# Altium schematic sheet [2] Sensors.SchDoc
size A4; DocumentNumber: 3; SheetNumber: 3; SheetTotal: 5
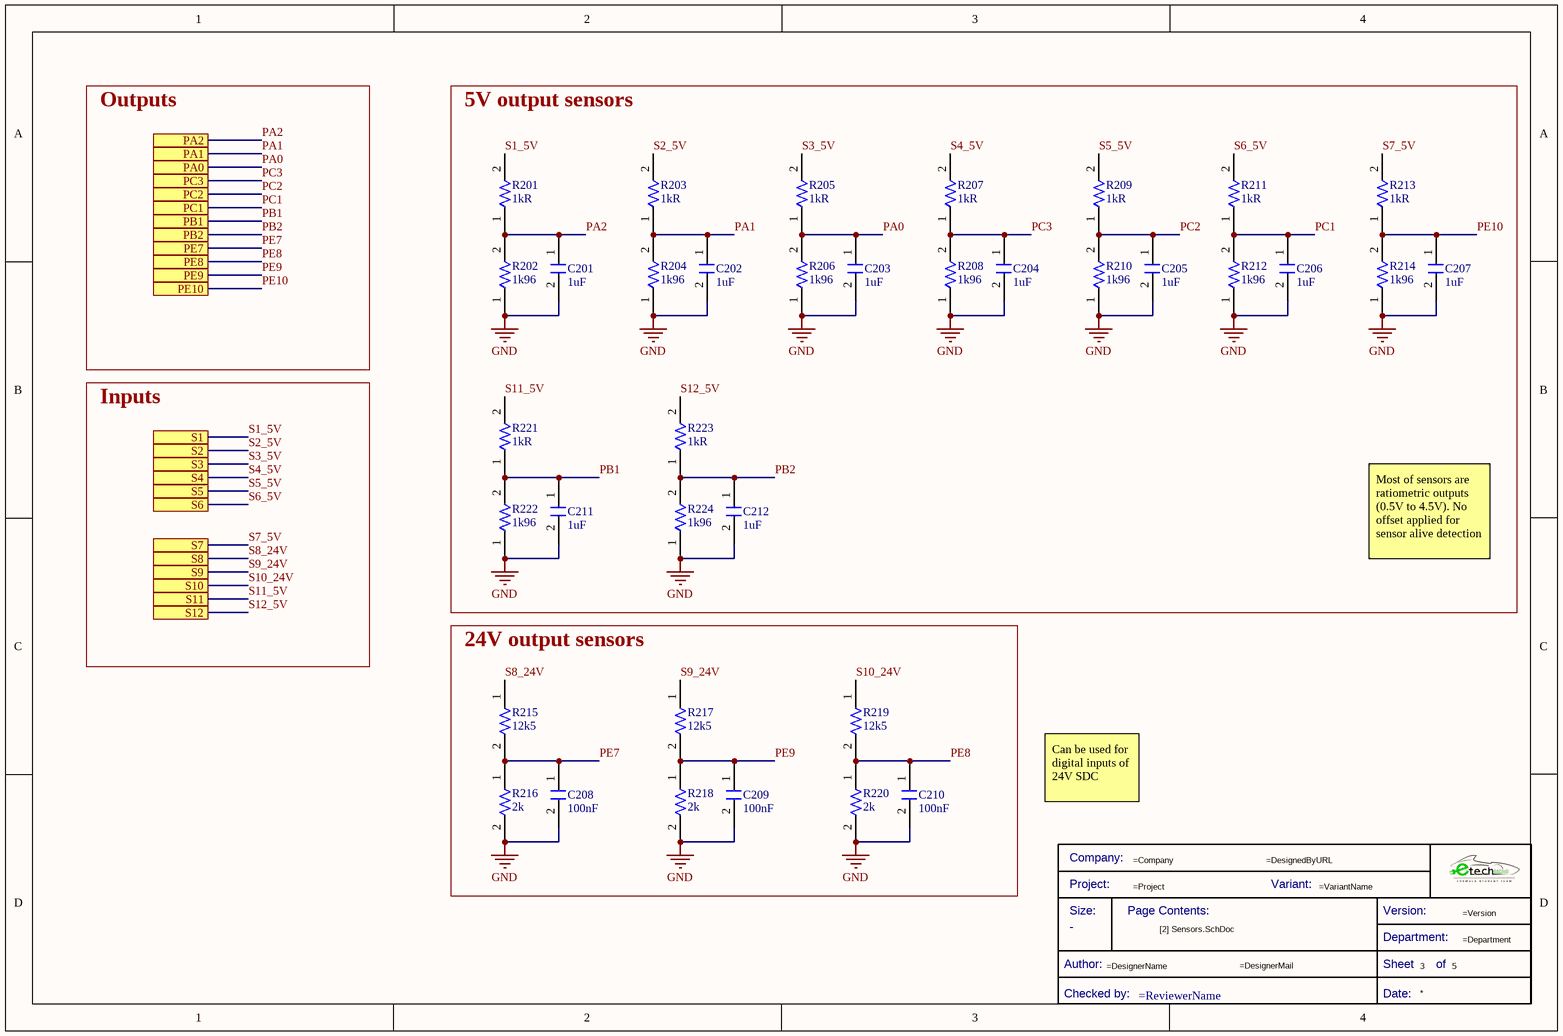
[diagram p0: [2] Sensors.SchDoc]

## Parts
*  Title Block_template  (value not drawn)  (graphical)
C201  Capacitance: 1uF  [C0805FNPC-R]  (hidden comment: 885012207103)
C202  Capacitance: 1uF  [C0805FNPC-R]  (hidden comment: 885012207103)
C203  Capacitance: 1uF  [C0805FNPC-R]  (hidden comment: 885012207103)
C204  Capacitance: 1uF  [C0805FNPC-R]  (hidden comment: 885012207103)
C205  Capacitance: 1uF  [C0805FNPC-R]  (hidden comment: 885012207103)
C206  Capacitance: 1uF  [C0805FNPC-R]  (hidden comment: 885012207103)
C207  Capacitance: 1uF  [C0805FNPC-R]  (hidden comment: 885012207103)
C208  Capacitance: 100nF  [C0805FNPC-R]  (hidden comment: 885012207098)
C209  Capacitance: 100nF  [C0805FNPC-R]  (hidden comment: 885012207098)
C210  Capacitance: 100nF  [C0805FNPC-R]  (hidden comment: 885012207098)
C211  Capacitance: 1uF  [C0805FNPC-R]  (hidden comment: 885012207103)
C212  Capacitance: 1uF  [C0805FNPC-R]  (hidden comment: 885012207103)
R201  Resistance: 1kR  [R0805FTK]  (hidden comment: CR0805-JW-102ELF)
R202  1k96  [R0805FTK]
R203  Resistance: 1kR  [R0805FTK]  (hidden comment: CR0805-JW-102ELF)
R204  1k96  [R0805FTK]
R205  Resistance: 1kR  [R0805FTK]  (hidden comment: CR0805-JW-102ELF)
R206  1k96  [R0805FTK]
R207  Resistance: 1kR  [R0805FTK]  (hidden comment: CR0805-JW-102ELF)
R208  1k96  [R0805FTK]
R209  Resistance: 1kR  [R0805FTK]  (hidden comment: CR0805-JW-102ELF)
R210  1k96  [R0805FTK]
R211  Resistance: 1kR  [R0805FTK]  (hidden comment: CR0805-JW-102ELF)
R212  1k96  [R0805FTK]
R213  Resistance: 1kR  [R0805FTK]  (hidden comment: CR0805-JW-102ELF)
R214  1k96  [R0805FTK]
R215  12k5  [R0805FTK]
R216  2k  [R0805FTK]
R217  12k5  [R0805FTK]
R218  2k  [R0805FTK]
R219  12k5  [R0805FTK]
R220  2k  [R0805FTK]
R221  Resistance: 1kR  [R0805FTK]  (hidden comment: CR0805-JW-102ELF)
R222  1k96  [R0805FTK]
R223  Resistance: 1kR  [R0805FTK]  (hidden comment: CR0805-JW-102ELF)
R224  1k96  [R0805FTK]

## Blocks framed on the sheet
5V output sensors: C201-C207 C211 C212 R201-R214 R221-R224
24V output sensors: C208-C210 R215-R220

## Ports
PA0 (see ETRX_FECU[2A], [1] Shield[3A]), PA1 (see ETRX_FECU[2A], [1] Shield[3A]), PA2 (see ETRX_FECU[2A], [1] Shield[3A]), PB1 (see ETRX_FECU[2B], [1] Shield[3B]), PB2 (see ETRX_FECU[2B], [1] Shield[3B]), PC1 (see ETRX_FECU[2B], [1] Shield[3A]), PC2 (see ETRX_FECU[2A], [1] Shield[3A]), PC3 (see ETRX_FECU[2A], [1] Shield[3A]), PE7 (see ETRX_FECU[2B], [1] Shield[3B]), PE8 (see ETRX_FECU[2B], [1] Shield[3B]), PE9 (see ETRX_FECU[2B], [1] Shield[3B]), PE10 (see ETRX_FECU[2B], [1] Shield[3B]), S1 (see ETRX_FECU[2A]), S2 (see ETRX_FECU[2A]), S3 (see ETRX_FECU[2A]), S4 (see ETRX_FECU[2A]), S5 (see ETRX_FECU[2A]), S6 (see ETRX_FECU[2A]), S7 (see ETRX_FECU[2A]), S8 (see ETRX_FECU[2A]), S9 (see ETRX_FECU[2A]), S10 (see ETRX_FECU[2B]), S11 (see ETRX_FECU[2B]), S12 (see ETRX_FECU[2B])

## Nets
GND: C201.2 C202.2 C203.2 C204.2 C205.2 C206.2 C207.2 C208.2 C209.2 C210.2 C211.2 C212.2 R202.1 R204.1 R206.1 R208.1 R210.1 R212.1 R214.1 R216.2 R218.2 R220.2 R222.1 R224.1
PA0: C203.1 R205.1 R206.2 ; port PA0
PA1: C202.1 R203.1 R204.2 ; port PA1
PA2: C201.1 R201.1 R202.2 ; port PA2
PB1: C211.1 R221.1 R222.2 ; port PB1
PB2: C212.1 R223.1 R224.2 ; port PB2
PC1: C206.1 R211.1 R212.2 ; port PC1
PC2: C205.1 R209.1 R210.2 ; port PC2
PC3: C204.1 R207.1 R208.2 ; port PC3
PE7: C208.1 R215.2 R216.1 ; port PE7
PE8: C210.1 R219.2 R220.1 ; port PE8
PE9: C209.1 R217.2 R218.1 ; port PE9
PE10: C207.1 R213.1 R214.2 ; port PE10
S1_5V: R201.2 ; port S1
S2_5V: R203.2 ; port S2
S3_5V: R205.2 ; port S3
S4_5V: R207.2 ; port S4
S5_5V: R209.2 ; port S5
S6_5V: R211.2 ; port S6
S7_5V: R213.2 ; port S7
S8_24V: R215.1 ; port S8
S9_24V: R217.1 ; port S9
S10_24V: R219.1 ; port S10
S11_5V: R221.2 ; port S11
S12_5V: R223.2 ; port S12

## Notes on the sheet
- Outputs
- Inputs
- Most of sensors are ratiometric outputs (0.5V to 4.5V). No offset applied for sensor alive detection
- Can be used for digital inputs of 24V SDC
- (in symbol Title Block_template) Company:; Project:; Variant:; Size:; Page Contents:; Version:; Department:; Author:; Sheet; of; Checked by:; Date:

## Library data of the parts
* = Title Block_template: Standard Title Block; .Creator: GP; Category: Title Block; .PCBcheck: GP; .SCHcheck: GP; Checked by:: =ReviewerName; Size: -
C201-C207 C211 C212 = C1u-50V-0805FNPC-X7R: Multilayer Ceramic Capacitor, Wcap-Csgp Series, 1 F, 10%, X7R, 50 V, 0805 [2012 Metric] Rohs Compliant: Yes; Manufacturer 1: Wurth Electronics; Voltage Rating: 50V; .Creator: GP; Supplier 1: RSComponents; Manufacturer Part Number 1: 885012207103; RoHS: Yes; Category: Ceramic Capacitors; Stock 1: 5100; Pricing 1: 50=0,27200, 250=0,25300, 500=0,22800, 1250=0,20100, 2500=0,17100 (GBP); Mount: Surface Mount; Case/Package: 0805; Case Code (Metric): 2012; Case Code (Imperial): 0805; Min Operating Temperature: -55°C; Max Operating Temperature: 85°C; Packaging: Cut Tape; Dielectric: X7R; Tolerance: 10%; Voltage Rating (DC): 50V; Length: 0.079inch; Width: 0.049inch; Thickness: 0.053inch; REACH SVHC: Unknown; RoHS Compliant: Yes; ComponentLink1URL: http://www.farnell.com/datasheets/1958501.pdf?src-supplier=Farnell; ComponentLink1Description: http://www.farnell.com/datasheets/1958501.pdf?src-supplier=Farnell; ComponentLink2URL: http://www.farnell.com/datasheets/1958501.pdf?src-supplier=Element14; ComponentLink2Description: http://www.farnell.com/datasheets/1958501.pdf?src-supplier=Element14; ComponentLink3URL: https://katalog.we-online.de/pbs/datasheet/885012107003.pdf?src-supplier=Digi-Key; ComponentLink3Description: https://katalog.we-online.de/pbs/datasheet/885012107003.pdf?src-supplier=Digi-Key; ComponentLink4URL: http://www.farnell.com/datasheets/1958501.pdf?src-supplier=Newark; ComponentLink4Description: http://www.farnell.com/datasheets/1958501.pdf?src-supplier=Newark; Supplier Part Number 1: 1813523
C208-C210 = C100n-50V-0805FNPC-X7R: Cap, 0.1ΜF, 50V, 10%, X7R, 0805; Manufacturer 1: Wurth Electronics; .Creator: DR; Supplier 1: RSComponents; Manufacturer Part Number 1: 885012207098; RoHS: Yes; Category: Ceramic Capacitors; Stock 1: 8000; Pricing 1: 100=0,10200, 500=0,07100, 2000=0,06100 (GBP); Mount: Surface Mount; Case/Package: 0805; Case Code (Metric): 2012; Case Code (Imperial): 0805; Min Operating Temperature: -55°C; Max Operating Temperature: 125°C; Packaging: Cut Tape; Voltage Rating: 50V; Dielectric: X7R; Tolerance: 10%; Voltage Rating (DC): 50V; Length: 0.079inch; Width: 0.049inch; Thickness: 0.035inch; REACH SVHC: Unknown; RoHS Compliant: Yes; ComponentLink1URL: http://www.farnell.com/datasheets/1958498.pdf?src-supplier=Farnell; ComponentLink1Description: http://www.farnell.com/datasheets/1958498.pdf?src-supplier=Farnell; ComponentLink2URL: http://www.farnell.com/datasheets/1958498.pdf?src-supplier=Element14; ComponentLink2Description: http://www.farnell.com/datasheets/1958498.pdf?src-supplier=Element14; ComponentLink3URL: https://katalog.we-online.de/pbs/datasheet/885012207098.pdf?src-supplier=Digi-Key; ComponentLink3Description: https://katalog.we-online.de/pbs/datasheet/885012207098.pdf?src-supplier=Digi-Key; ComponentLink4URL: http://www.farnell.com/datasheets/1958498.pdf?src-supplier=Newark; ComponentLink4Description: http://www.farnell.com/datasheets/1958498.pdf?src-supplier=Newark; Supplier Part Number 1: 1813493
R201 R203 R205 R207 R209 R211 R213 R221 R223 = R1k-0805FTK: Res Thick Film 0805 1K Ohm 5% 1/8W ±200ppm/°C Molded SMD SMD Paper Tape on Plastic Reel; Manufacturer 1: Bourns; Voltage Rating (DC): 150V; Power Rating: 125mW; .Creator: GP; Supplier 1: Arrow Electronics; Manufacturer Part Number 1: CR0805-JW-102ELF; RoHS: Yes; Category: Chip SMD Resistors; Stock 1: 27510; Pricing 1: 1=0,05930, 10=0,03510, 25=0,01790, 100=0,00800, 250=0,00790, 500=0,00590, 1000=0,00360, 3000=0,00350, 6000=0,00250 (USD); Mount: Surface Mount; Case/Package: 0805; Number of Pins: 2; Contact Plating: Tin; Case Code (Metric): 2012; Case Code (Imperial): 0805; Min Operating Temperature: -55°C; Max Operating Temperature: 155°C; Resistor Type: Thick Film; Tolerance: 5%; Temperature Coefficient: 200ppm/°C; Features: Moisture Resistant; Package Quantity: 1; Packaging: Tape and Reel; Voltage Rating: 150V; Number of Terminations: 2; Termination: SMD/SMT; Max Power Dissipation: 125mW; Length: 2mm; Width: 1.25mm; Height: 0.5mm; Thickness: 508um; Depth: 1.25mm; Radiation Hardening: No; Lead Free: Lead Free; REACH SVHC: No SVHC; Military Standard: Not; ComponentLink1URL: https://datasheet.ciiva.com/11821/0900766b80fcdb72-11821134.pdf?src-supplier=RSComponents; ComponentLink1Description: https://datasheet.ciiva.com/11821/0900766b80fcdb72-11821134.pdf?src-supplier=RSComponents; ComponentLink2URL: https://datasheet.ciiva.com/15225/getdatasheetpartid-78155-15225381.pdf?src-supplier=Verical; ComponentLink2Description: https://datasheet.ciiva.com/15225/getdatasheetpartid-78155-15225381.pdf?src-supplier=Verical; ComponentLink3URL: https://datasheet.ciiva.com/22693/1902866-22693253.pdf?src-supplier=Element14; ComponentLink3Description: https://datasheet.ciiva.com/22693/1902866-22693253.pdf?src-supplier=Element14; ComponentLink4URL: https://datasheet.ciiva.com/7986/1856384-7986184.pdf?src-supplier=Element14; ComponentLink4Description: https://datasheet.ciiva.com/7986/1856384-7986184.pdf?src-supplier=Element14; ComponentLink5URL: https://datasheet.ciiva.com/7985/1856384-7985867.pdf?src-supplier=Element14; ComponentLink5Description: https://datasheet.ciiva.com/7985/1856384-7985867.pdf?src-supplier=Element14; ComponentLink6URL: https://datasheet.ciiva.com/30242/159chpreztr-30242765.pdf?src-supplier=Onlinecomponents.com; ComponentLink6Description: https://datasheet.ciiva.com/30242/159chpreztr-30242765.pdf?src-supplier=Onlinecomponents.com; ComponentLink7URL: https://datasheet.ciiva.com/6547/chpreztr-6547359.pdf?src-supplier=Digi-Key; ComponentLink7Description: https://datasheet.ciiva.com/6547/chpreztr-6547359.pdf?src-supplier=Digi-Key; Supplier Part Number 1: CR0805-JW-102ELF
R202 R204 R206 R208 R210 R212 R214 R222 R224 = R1k96-0805FTK
R215 R217 R219 = R12k5-0805FTK
R216 R218 R220 = R2k-0805FTK